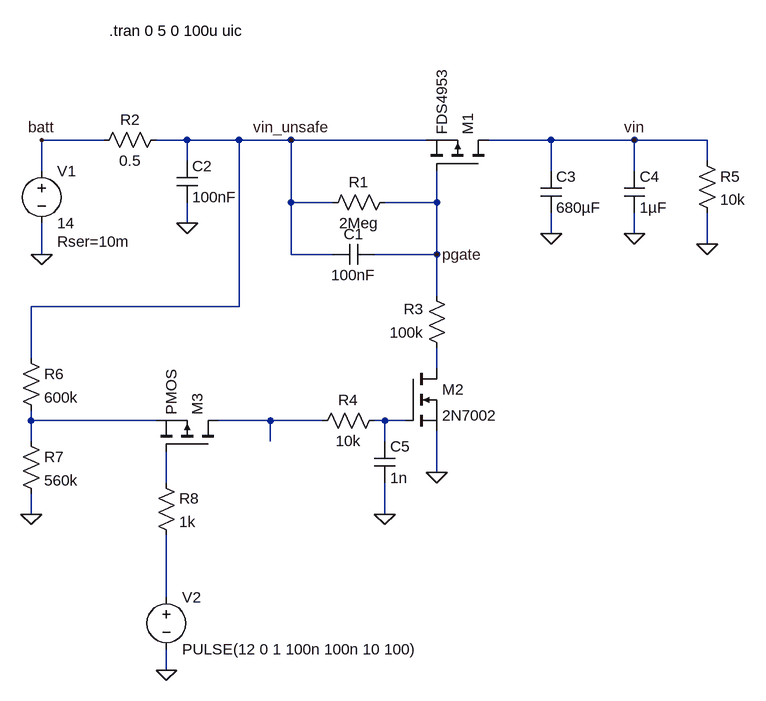
[diagram p0: schematic softstart.asc]
softstart.asc, the LTspice schematic file:
Version 4
SHEET 1 880 852
WIRE -240 -32 -336 -32
WIRE -112 -32 -160 -32
WIRE -32 -32 -112 -32
WIRE 48 -32 -32 -32
WIRE 256 -32 48 -32
WIRE 448 -32 352 -32
WIRE 576 -32 448 -32
WIRE 688 -32 576 -32
WIRE -112 0 -112 -32
WIRE 688 0 688 -32
WIRE -336 16 -336 -32
WIRE 448 16 448 -32
WIRE 576 16 576 -32
WIRE 48 64 48 -32
WIRE 112 64 48 64
WIRE 272 64 272 16
WIRE 272 64 192 64
WIRE -112 96 -112 64
WIRE 448 112 448 80
WIRE 576 112 576 80
WIRE 688 128 688 80
WIRE -336 144 -336 96
WIRE 48 144 48 64
WIRE 112 144 48 144
WIRE 272 144 272 64
WIRE 272 144 176 144
WIRE 272 208 272 144
WIRE -32 224 -32 -32
WIRE -32 224 -352 224
WIRE -352 304 -352 224
WIRE 272 320 272 288
WIRE -352 400 -352 384
WIRE -160 400 -352 400
WIRE 16 400 -64 400
WIRE 96 400 16 400
WIRE 192 400 176 400
WIRE 224 400 192 400
WIRE -352 432 -352 400
WIRE 16 432 16 400
WIRE 192 432 192 400
WIRE 272 480 272 416
WIRE -144 496 -144 448
WIRE -352 544 -352 512
WIRE 192 544 192 496
WIRE -144 672 -144 576
WIRE -144 784 -144 752
FLAG 272 480 0
FLAG -112 96 0
FLAG -336 144 0
FLAG 448 112 0
FLAG 576 112 0
FLAG 576 -32 vin
FLAG 48 -32 vin_unsafe
FLAG -336 -32 batt
FLAG 688 128 0
FLAG 272 144 pgate
FLAG -352 544 0
FLAG -144 784 0
FLAG 192 544 0
SYMBOL pmos 352 16 M270
SYMATTR InstName M1
SYMATTR Value FDS4953
SYMBOL nmos 224 320 R0
SYMATTR InstName M2
SYMATTR Value 2N7002
SYMBOL res 208 48 R90
WINDOW 0 0 56 VBottom 2
WINDOW 3 32 56 VTop 2
SYMATTR InstName R1
SYMATTR Value 2Meg
SYMBOL res 288 304 R180
WINDOW 0 36 76 Left 2
WINDOW 3 36 40 Left 2
SYMATTR InstName R3
SYMATTR Value 100k
SYMBOL cap 176 128 R90
WINDOW 0 0 32 VBottom 2
WINDOW 3 32 32 VTop 2
SYMATTR InstName C1
SYMATTR Value 100nF
SYMBOL res -144 -48 R90
WINDOW 0 0 56 VBottom 2
WINDOW 3 32 56 VTop 2
SYMATTR InstName R2
SYMATTR Value 0.5
SYMBOL cap -128 0 R0
SYMATTR InstName C2
SYMATTR Value 100nF
SYMATTR SpiceLine Rser=1m
SYMBOL res 192 384 R90
WINDOW 0 0 56 VBottom 2
WINDOW 3 32 56 VTop 2
SYMATTR InstName R4
SYMATTR Value 10k
SYMBOL voltage -336 0 R0
WINDOW 123 0 0 Left 0
WINDOW 39 24 124 Left 2
SYMATTR SpiceLine Rser=10m
SYMATTR InstName V1
SYMATTR Value 14
SYMBOL voltage -144 656 R0
WINDOW 123 0 0 Left 0
WINDOW 39 0 0 Left 0
SYMATTR InstName V2
SYMATTR Value PULSE(12 0 1 100n 100n 10 100)
SYMBOL cap 432 16 R0
SYMATTR InstName C3
SYMATTR Value 680µF
SYMATTR SpiceLine Rser=100m
SYMBOL cap 560 16 R0
SYMATTR InstName C4
SYMATTR Value 1µF
SYMATTR SpiceLine Rser=10m
SYMBOL res 672 -16 R0
SYMATTR InstName R5
SYMATTR Value 10k
SYMBOL res -368 288 R0
SYMATTR InstName R6
SYMATTR Value 600k
SYMBOL res -368 416 R0
SYMATTR InstName R7
SYMATTR Value 560k
SYMBOL pmos -64 448 M270
SYMATTR InstName M3
SYMBOL res -160 480 R0
SYMATTR InstName R8
SYMATTR Value 1k
SYMBOL cap 176 432 R0
SYMATTR InstName C5
SYMATTR Value 1n
TEXT -232 -200 Left 2 !.tran 0 5 0 100u uic

The netlist it stands for:
* softstart.asc
M1 vin pgate vin_unsafe vin_unsafe FDS4953
M2 N001 N004 0 0 2N7002
R1 pgate vin_unsafe 2Meg
R3 N001 pgate 100k
C1 pgate vin_unsafe 100nF
R2 vin_unsafe batt 0.5
C2 vin_unsafe 0 100nF Rser=1m
R4 N004 N003 10k
V1 batt 0 14 Rser=10m
V2 N006 0 PULSE(12 0 1 100n 100n 10 100)
C3 vin 0 680µF Rser=100m
C4 vin 0 1µF Rser=10m
R5 vin 0 10k
R6 vin_unsafe N002 600k
R7 N002 0 560k
M3 N003 N005 N002 N002 PMOS
R8 N005 N006 1k
C5 N004 0 1n
.model NMOS NMOS
.model PMOS PMOS
.lib standard.mos
.tran 0 5 0 100u uic
.backanno
.end